# Altium schematic sheet main.SCHDOC
size A3
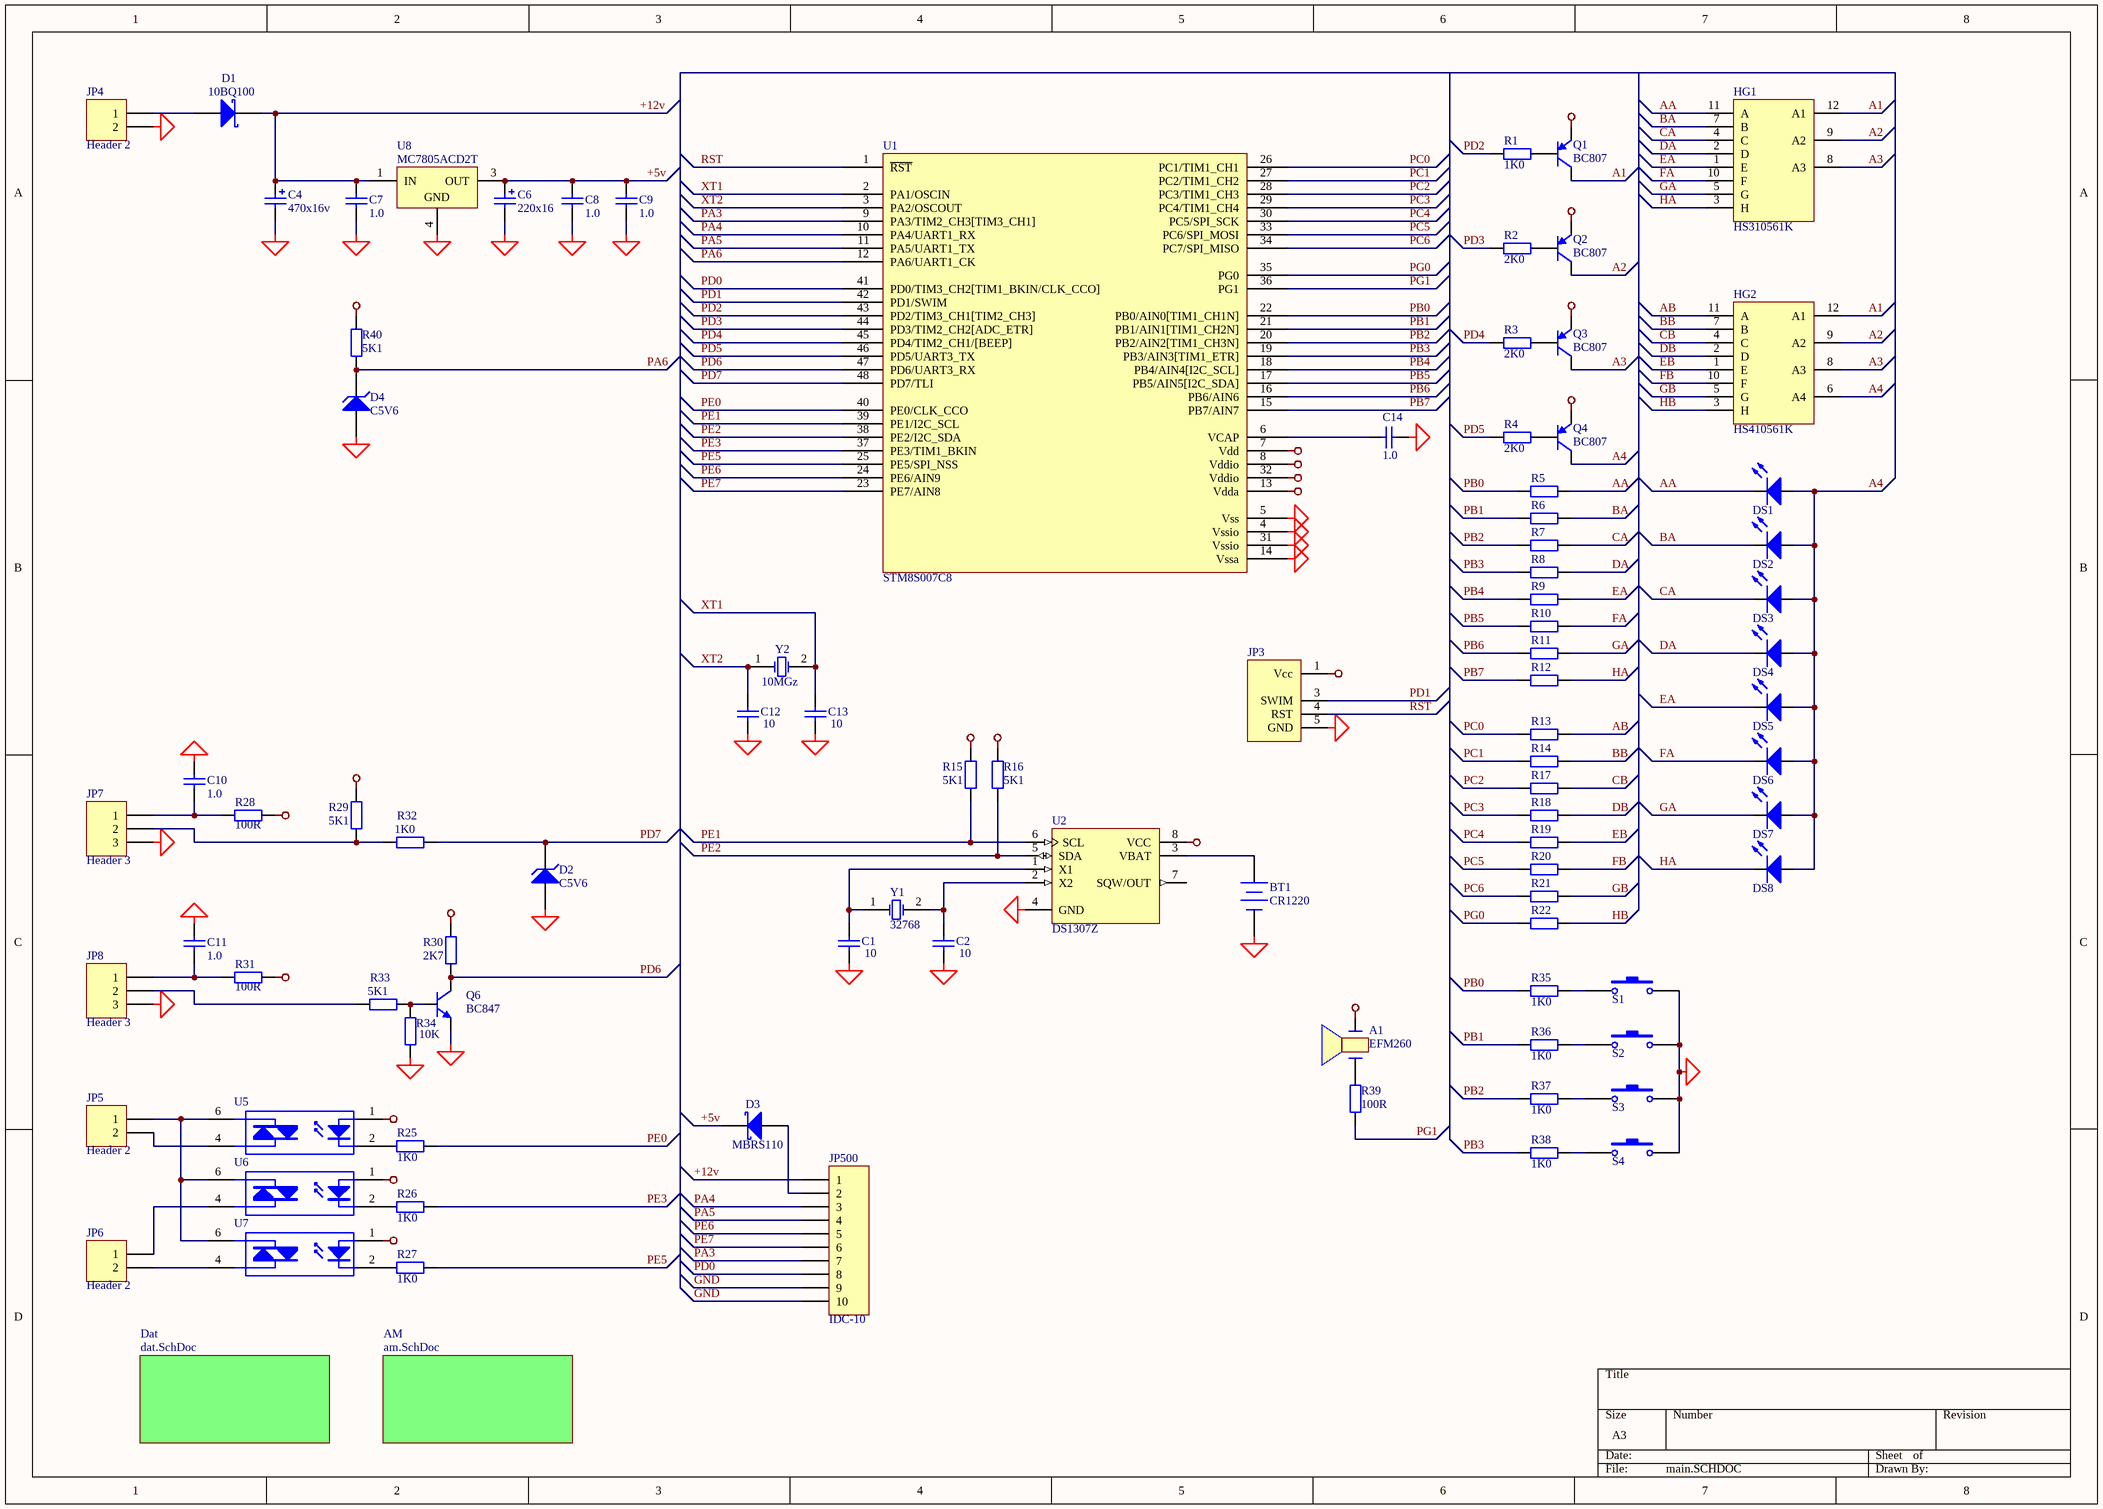
[diagram p0: main.SCHDOC]

## Parts
A1  EFM260  [zumm]
BT1  CR1220  [1220_holder]
C1  10  [_1206]
C2  10  [_1206]
C4  value 470x16v  [el5]
C6  value 220x16  [el3]
C7  value 1.0  [_1206]  (hidden comment: Cap)
C8  value 1.0  [_1206]  (hidden comment: Cap)
C9  value 1.0  [_1206]  (hidden comment: Cap)
C10  value 1.0  [_1206]  (hidden comment: Cap)
C11  value 1.0  [_1206]  (hidden comment: Cap)
C12  10  [_1206]
C13  10  [_1206]
C14  1.0  [_1206]
D1  10BQ100  [DSO-C2/X2.3]
D2  C5V6  [_1206d]
D3  MBRS110  [DSO-C2/X2.3]
D4  C5V6  [_1206d]
DS1  LED0  [el3]  (value not drawn)
DS2  LED0  [el3]  (value not drawn)
DS3  LED0  [el3]  (value not drawn)
DS4  LED0  [el3]  (value not drawn)
DS5  LED0  [el3]  (value not drawn)
DS6  LED0  [el3]  (value not drawn)
DS7  LED0  [el3]  (value not drawn)
DS8  LED0  [el3]  (value not drawn)
HG1  HS310561K  [HS310561K]
HG2  HS410561K  [HS410561K]
JP3  (no value)  [HDR1X5_uart]
JP4  Header 2  [BT5-2]
JP5  Header 2  [BT5-2]
JP6  Header 2  [BT5-2]
JP7  Header 3  [BT5-3]
JP8  Header 3  [BT5-3]
JP500  IDC-10  [HDR2X5]
Q1  BC807  [SO-G3]
Q2  BC807  [SO-G3]
Q3  BC807  [SO-G3]
Q4  BC807  [SO-G3]
Q6  BC847  [SO-G3]
R1  value 1K0  [_1206]  (hidden comment: Res2)
R2  value 2K0  [_1206]  (hidden comment: Res2)
R3  value 2K0  [_1206]  (hidden comment: Res2)
R4  value 2K0  [_1206]  (hidden comment: Res2)
R5  Res2  [_1206]  (value not drawn)
R6  Res2  [_1206]  (value not drawn)
R7  Res2  [_1206]  (value not drawn)
R8  Res2  [_1206]  (value not drawn)
R9  Res2  [_1206]  (value not drawn)
R10  Res2  [_1206]  (value not drawn)
R11  Res2  [_1206]  (value not drawn)
R12  Res2  [_1206]  (value not drawn)
R13  Res2  [_1206]  (value not drawn)
R14  Res2  [_1206]  (value not drawn)
R15  value 5K1  [_1206]  (hidden comment: Res2)
R16  value 5K1  [_1206]  (hidden comment: Res2)
R17  Res2  [_1206]  (value not drawn)
R18  Res2  [_1206]  (value not drawn)
R19  Res2  [_1206]  (value not drawn)
R20  Res2  [_1206]  (value not drawn)
R21  Res2  [_1206]  (value not drawn)
R22  Res2  [_1206]  (value not drawn)
R25  value 1K0  [_1206]  (hidden comment: Res2)
R26  value 1K0  [_1206]  (hidden comment: Res2)
R27  value 1K0  [_1206]  (hidden comment: Res2)
R28  value 100R  [_1206]  (hidden comment: Res2)
R29  value 5K1  [_1206]  (hidden comment: Res2)
R30  value 2K7  [_1206]  (hidden comment: Res2)
R31  value 100R  [_1206]  (hidden comment: Res2)
R32  1K0  [_1206]
R33  5K1  [_1206]
R34  10K  [_1206]
R35  value 1K0  [_1206]  (hidden comment: Res2)
R36  value 1K0  [_1206]  (hidden comment: Res2)
R37  value 1K0  [_1206]  (hidden comment: Res2)
R38  value 1K0  [_1206]  (hidden comment: Res2)
R39  value 100R  [_1206]  (hidden comment: Res2)
R40  5K1  [_1206]
S1  SWT-6  [SWT-6]  (value not drawn)
S2  SWT-6  [SWT-6]  (value not drawn)
S3  SWT-6  [SWT-6]  (value not drawn)
S4  SWT-6  [SWT-6]  (value not drawn)
U1  STM8S007C8  [F-QFP7X7-G48/X.3N]
U2  DS1307Z  [SO-G8/Z7.45]
U5  Opto TRIAC  [DIP-6]  (value not drawn)
U6  Opto TRIAC  [DIP-6]  (value not drawn)
U7  Opto TRIAC  [DIP-6]  (value not drawn)
U8  MC7805ACD2T  [D2PAK]
Y1  32768  [BCY-W2/D3.1]
Y2  10MGz  [qwarz1]

## Sub-sheets
AM = am.SchDoc: no entries
Dat = dat.SchDoc: no entries

## Nets
+5v: A1.1 C6.1 C8.2 C9.2 D3.2(K) JP3.1(Vcc) Q1.2(E) Q2.2(E) Q3.2(E) Q4.2(E) R15.1 R16.1 R28.2 R29.1 R30.1 R31.2 U1.7(Vdd) U1.8(Vddio) U1.13(Vdda) U1.32(Vddio) U2.8(VCC) U5.1(A) U6.1(A) U7.1(A) U8.3(OUT)
+12v: C4.1 C7.2 D1.2(K) JP500.1 R40.1 U8.1(IN)
GND: BT1.2(-) C1.1 C2.1 C4.2 C6.2 C7.1 C8.1 C9.1 C10.2 C11.2 C12.1 C13.1 C14.1 D2.1(A) D4.1(A) JP3.5(GND) JP4.2 JP7.3 JP8.3 JP500.9 JP500.10 Q6.2(E) R34.2 S1.2 S2.2 S3.2 S4.2 U1.4(Vssio) U1.5(Vss) U1.14(Vssa) U1.31(Vssio) U2.4(GND) U8.4(GND)
A1: HG1.12(A1) HG2.12(A1) Q1.3(C)
A2: HG1.9(A2) HG2.9(A2) Q2.3(C)
A3: HG1.8(A3) HG2.8(A3) Q3.3(C)
A4: DS1.1(A) DS2.1(A) DS3.1(A) DS4.1(A) DS5.1(A) DS6.1(A) DS7.1(A) DS8.1(A) HG2.6(A4) Q4.3(C)
AA: DS1.2(K) HG1.11(A) R5.1
AB: HG2.11(A) R13.1
BA: DS2.2(K) HG1.7(B) R6.1
BB: HG2.7(B) R14.1
CA: DS3.2(K) HG1.4(C) R7.1
CB: HG2.4(C) R17.1
DA: DS4.2(K) HG1.2(D) R8.1
DB: HG2.2(D) R18.1
EA: DS5.2(K) HG1.1(E) R9.1
EB: HG2.1(E) R19.1
FA: DS6.2(K) HG1.10(F) R10.1
FB: HG2.10(F) R20.1
GA: DS7.2(K) HG1.5(G) R11.1
GB: HG2.5(G) R21.1
HA: DS8.2(K) HG1.3(H) R12.1
HB: HG2.3(H) R22.1
PA3: JP500.7 U1.9(PA3/TIM2_CH3[TIM3_CH1])
PA4: JP500.3 U1.10(PA4/UART1_RX)
PA5: JP500.4 U1.11(PA5/UART1_TX)
PA6: D4.2(K) R40.2 U1.12(PA6/UART1_CK)
PB0: R5.2 R35.2 U1.22(PB0/AIN0[TIM1_CH1N])
PB1: R6.2 R36.2 U1.21(PB1/AIN1[TIM1_CH2N])
PB2: R7.2 R37.2 U1.20(PB2/AIN2[TIM1_CH3N])
PB3: R8.2 R38.2 U1.19(PB3/AIN3[TIM1_ETR])
PB4: R9.2 U1.18(PB4/AIN4[I2C_SCL])
PB5: R10.2 U1.17(PB5/AIN5[I2C_SDA])
PB6: R11.2 U1.16(PB6/AIN6)
PB7: R12.2 U1.15(PB7/AIN7)
PC0: R13.2 U1.26(PC1/TIM1_CH1)
PC1: R14.2 U1.27(PC2/TIM1_CH2)
PC2: R17.2 U1.28(PC3/TIM1_CH3)
PC3: R18.2 U1.29(PC4/TIM1_CH4)
PC4: R19.2 U1.30(PC5/SPI_SCK)
PC5: R20.2 U1.33(PC6/SPI_MOSI)
PC6: R21.2 U1.34(PC7/SPI_MISO)
PD0: JP500.8 U1.41(PD0/TIM3_CH2[TIM1_BKIN/CLK_CCO])
PD1: JP3.3(SWIM) U1.42(PD1/SWIM)
PD2: R1.2 U1.43(PD2/TIM3_CH1[TIM2_CH3])
PD3: R2.2 U1.44(PD3/TIM2_CH2[ADC_ETR])
PD4: R3.2 U1.45(PD4/TIM2_CH1/[BEEP])
PD5: R4.2 U1.46(PD5/UART3_TX)
PD6: Q6.3(C) R30.2 U1.47(PD6/UART3_RX)
PD7: D2.2(K) R32.1 U1.48(PD7/TLI)
PE0: R25.2 U1.40(PE0/CLK_CCO)
PE1: R15.2 U1.39(PE1/I2C_SCL) U2.6(SCL)
PE2: R16.2 U1.38(PE2/I2C_SDA) U2.5(SDA)
PE3: R26.2 U1.37(PE3/TIM1_BKIN)
PE5: R27.2 U1.25(PE5/SPI_NSS)
PE6: JP500.5 U1.24(PE6/AIN9)
PE7: JP500.6 U1.23(PE7/AIN8)
PG0: R22.2 U1.35(PG0)
PG1: R39.2 U1.36(PG1)
RST: JP3.4(RST) U1.1(~{RST})
XT1: C13.2 U1.2(PA1/OSCIN) Y2.2(OSC2)
XT2: C12.2 U1.3(PA2/OSCOUT) Y2.1(OSC1)
NetA1_2: A1.2 R39.1
NetBT1_1: BT1.1(+) U2.3(VBAT)
NetC1_2: C1.2 U2.1(X1) Y1.1(OSC1)
NetC2_2: C2.2 U2.2(X2) Y1.2(OSC2)
NetC10_1: C10.1 JP7.1 R28.1
NetC11_1: C11.1 JP8.1 R31.1
NetC14_2: C14.2 U1.6(VCAP)
NetD1_1: D1.1(A) JP4.1
NetD3_1: D3.1(A) JP500.2
NetJP5_1: JP5.1 U5.6(A/K) U6.6(A/K) U7.6(A/K)
NetJP5_2: JP5.2 U5.4(A/K)
NetJP6_1: JP6.1 U6.4(A/K)
NetJP6_2: JP6.2 U7.4(A/K)
NetJP7_2: JP7.2 R29.2 R32.2
NetJP8_2: JP8.2 R33.2
NetQ1_1: Q1.1(B) R1.1
NetQ2_1: Q2.1(B) R2.1
NetQ3_1: Q3.1(B) R3.1
NetQ4_1: Q4.1(B) R4.1
NetQ6_1: Q6.1(B) R33.1 R34.1
NetR25_1: R25.1 U5.2(K)
NetR26_1: R26.1 U6.2(K)
NetR27_1: R27.1 U7.2(K)
NetR35_1: R35.1 S1.1
NetR36_1: R36.1 S2.1
NetR37_1: R37.1 S3.1
NetR38_1: R38.1 S4.1

Not connected (* = marked no-connect by the designer): U2 7(SQW/OUT)

## Library data of the parts
A1 = PJEZ0: Beeper; Value: EFM260
BT1 = Battery: Multicell Battery; Manufacturer: Generic Components; Published: 24-Mar-1999; Revision: July-2002: Re-released for DXP Platform.; Publisher: Altium Limited
C1 C2 C12-C14 = Cap Semi: Capacitor; Manufacturer: Generic Components; Class I: Passive; Value: 0,1; Published: 8-Jun-2000; Revision: July-2002: Re-released for DXP Platform.; Publisher: Altium Limited; Class II: Capacitor
C4 = Cap Pol1: Polarized Capacitor (Radial); Manufacturer: Generic Components; Class I: Passive; Published: 8-Jun-2000; Revision: July-2002: Re-released for DXP Platform.; Publisher: Altium Limited; Class II: Capacitor
C6 = Cap Pol: Polarized Capacitor (Radial); Manufacturer: Generic Components; Class I: Passive; Published: 8-Jun-2000; Revision: July-2002: Re-released for DXP Platform.; Publisher: Altium Limited; Class II: Capacitor
C7-C11 = Cap: Capacitor; Manufacturer: Generic Components; Class I: Passive; Published: 8-Jun-2000; Revision: July-2002: Re-released for DXP Platform.; Publisher: Altium Limited; Class II: Capacitor
D1 D3 = 10BQ015: Schottky Rectifier; Manufacturer: International Rectifier; Revision 1: 10-July-2000: SIM Model Added.; Revision 2: July-2002: Re-released for DXP Platform.; Class I: Discrete; Class II: Rectifier - Schottky; Published: 8-Jun-2000; Datasheet: Latest Revision: PD-2.396A; Package Reference: DO-214AA; Publisher: Altium Limited
D2 D4 = D Zener: Zener Diode; Manufacturer: Generic Components; Class I: Discrete; Class II: Diode - Zener; Published: 8-Jun-2000; Revision: July-2002: Re-released for DXP Platform.; Publisher: Altium Limited
DS1-DS8 = LED0: Typical INFRARED GaAs LED; Manufacturer: Generic Components; Class I: Optoelectronic; Published: 8-Jun-2000; Revision: July-2002: Re-released for DXP Platform.; Publisher: Altium Limited; Class II: LED
JP3 = SWIM_CONN
JP4-JP6 = Header 2: Header, 2-Pin; Manufacturer: Generic Components; Class I: Connector; Revision: July-2002: Re-released for DXP Platform.; Publisher: Altium Limited
JP7 JP8 = Header 3: Header, 3-Pin; Manufacturer: Generic Components; Class I: Connector; Revision: July-2002: Re-released for DXP Platform.; Publisher: Altium Limited
JP500 = Header 10: Header, 10-Pin; Manufacturer: Generic Components; Class I: Connector; Revision: July-2002: Re-released for DXP Platform.; Publisher: Altium Limited
Q1-Q4 = BC857ALT1: General Purpose Transistor PNP Silicon; Manufacturer: Motorola; Package Information: Latest Revision: 1997; Class I: Discrete; Class II: BJT - Low Power; Published: 29-Sep-2000; Revision: July-2002: Re-released for DXP Platform.; Datasheet: Latest Revision: 1997; Package Reference: 318-08; Publisher: Altium Limited
Q6 = BC847ALT1: General Purpose Transistor NPN Silicon; Manufacturer: Motorola; Package Information: Latest Revision: 1997; Class I: Discrete; Class II: BJT - Low Power; Published: 29-Sep-2000; Revision: July-2002: Re-released for DXP Platform.; Datasheet: Latest Revision: 1997; Package Reference: 318-08; Publisher: Altium Limited
R1-R4 R15 R16 R25-R31 R34-R39 = Res2: Resistor; Manufacturer: Generic Components; Class I: Passive; Published: 8-Jun-2000; Revision: July-2002: Re-released for DXP Platform.; Publisher: Altium Limited; Class II: Resistor
  R34: Value: 10K
R5-R14 R17-R22 = Res2: Resistor; Manufacturer: Generic Components; Class I: Passive; Value: 100R; Published: 8-Jun-2000; Revision: July-2002: Re-released for DXP Platform.; Publisher: Altium Limited; Class II: Resistor
R32 R33 R40 = Res2: Resistor; Manufacturer: Generic Components; Class I: Passive; Value: 1K; Published: 8-Jun-2000; Revision: July-2002: Re-released for DXP Platform.; Publisher: Altium Limited; Class II: Resistor
S1-S4 = SWT-6: Switch; Manufacturer: Generic Components; Published: 24-Mar-1999; Revision: July-2002: Re-released for DXP Platform.; Publisher: Altium Limited
U2 = DS1307Z: 64 X 8 Serial Real-Time Clock; Manufacturer: Dallas Semiconductor; Package Information: Latest Revision: 1999; Class I: Peripheral; Class II: Real Time Clock; Published: 13-Oct-2000; Revision: July-2002: Re-released for DXP Platform.; Datasheet: Latest Revision: 10-Aug-1999; Package Reference: SOIC8N; Publisher: Altium Limited
U5-U7 = Opto TRIAC: Opto-Triac; Manufacturer: Generic Components; Class I: Optoelectronic; Published: 24-Mar-1999; Revision: July-2002: Re-released for DXP Platform.; Publisher: Altium Limited
U8 = MC7805ACD2T: Three-Terminal Positive Voltage Regulator; Manufacturer: ON Semiconductor; Package Information: Latest Revision: 1997; Class I: Power Management; Note: Pin 2 is electrically connected to Pin 4; Pin 2 is trimmed and not drawn;; Published: 15-Apr-2002; Datasheet: Latest Revision: 1997; Package Reference: 936-03; Publisher: Altium Limited; Class II: Voltage Regulator
Y1 Y2 = XTAL: Crystal Oscillator; Manufacturer: Generic Components; Published: 8-Jun-2000; Revision: July-2002: Re-released for DXP Platform.; Publisher: Altium Limited; Class I: Oscillator; Class II: Crystal Oscillator